# Altium schematic sheet Tut3.SchDoc
size A4; SheetNumber: 1; SheetTotal: 1
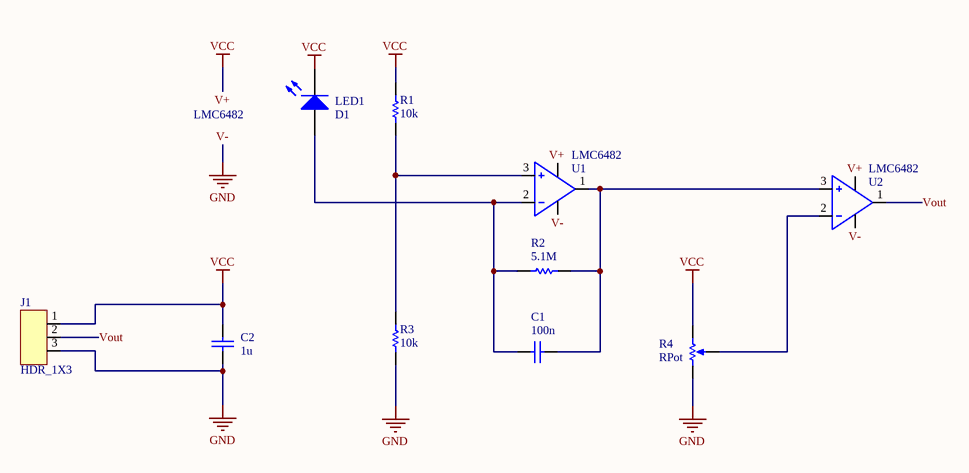
[diagram p0: Tut3.SchDoc]

## Parts
C1  100n  [RAD-0.3]
C2  1u  [RAD-0.3]
D1  LED1  [LED-1]
J1  HDR_1X3
R1  10k  [AXIAL-0.3]
R2  5.1M  [AXIAL-0.3]
R3  10k  [AXIAL-0.3]
R4  RPot  [VR5]
U1  LMC6482
U2  LMC6482

## Nets
V+: C2.2 D1.2(K) J1.1 R1.2 R4.2(BOT) U1.4 U2.4  [also labelled VCC]
V-: C2.1 J1.3 R3.1 R4.1(TOP) U1.5 U2.5  [also labelled GND]
Vout: J1.2 U2.1
NetC1_1: C1.1 D1.1(A) R2.1 U1.2
NetC1_2: C1.2 R2.2 U1.1 U2.3
NetR1_1: R1.1 R3.2 U1.3
NetR4_3: R4.3(TAP) U2.2

## Notes on the sheet
- LMC6482

## Library data of the parts
C1 C2 = Cap: Capacitor; Value: 100pF; Published: 8-Jun-2000; LatestRevisionDate: 17-Jul-2002; LatestRevisionNote: Re-released for DXP Platform.; PackageReference: RAD-0.3; Publisher: Altium Limited; PackageDescription: Radial Cap, Thru-Hole; 2 Leads; 0.3 in Pin Spacing
D1 = LED1: Typical RED GaAs LED; Published: 8-Jun-2000; LatestRevisionDate: 08-Jul-2005; LatestRevisionNote: Mech Layer 1 removed.; PackageReference: LED-1; Publisher: Altium Limited; PackageDescription: LED; 2 Leads
J1 = HDR_1X3: 1X3 Header Connector
R1-R3 = Res1: Resistor; Value: 1K; Published: 8-Jun-2000; LatestRevisionDate: 17-Jul-2002; LatestRevisionNote: Re-released for DXP Platform.; PackageReference: AXIAL-0.3; Publisher: Altium Limited; PackageDescription: Axial Device, Thru-Hole; 2 Leads; 0.3 in Pin Spacing
R4 = RPot: Potentiometer; Sim Note: Enter the Resistance value and the set point into parameter fields.; Set Position: 0.5; Value: 1K; Published: 8-Jun-2000; LatestRevisionDate: 17-Jul-2002; LatestRevisionNote: Re-released for DXP Platform.; PackageReference: VR5; Publisher: Altium Limited; PackageDescription: Variable Resistor, Thru-Hole; 3 Leads
U1 U2 = LMC6482: CMOS Amplifier 2 Circuit Rail-to-Rail 8-SOIC